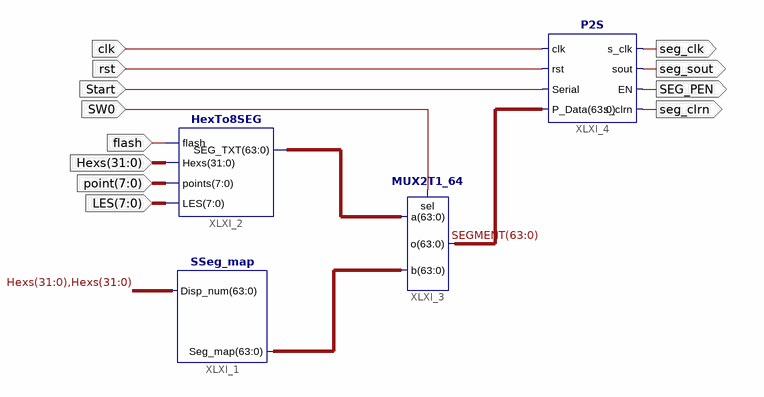
[diagram p0: schematic sheet 1]
// Xilinx ISE schematic SSeg7_Dev.sch (kintex7) as structural Verilog: 4 symbols, 12 ports
module SSeg7_Dev (
  input  flash,
  input  [31:0] Hexs,
  input  [7:0] LES,
  input  [7:0] point,
  input  clk,
  input  rst,
  input  Start,
  input  SW0,
  output seg_clk,
  output seg_sout,
  output SEG_PEN,
  output seg_clrn
);

  wire [63:0] SEGMENT, XLXN_4, XLXN_5;

  SSeg_map XLXI_1 (.Disp_num({Hexs, Hexs}), .Seg_map(XLXN_5));
  HexTo8SEG XLXI_2 (.LES(LES), .points(point), .Hexs(Hexs), .SEG_TXT(XLXN_4), .flash(flash));
  MUX2T1_64 XLXI_3 (.b(XLXN_5), .sel(SW0), .a(XLXN_4), .o(SEGMENT));
  P2S XLXI_4 (
    .s_clrn(seg_clrn), .sout(seg_sout), .rst(rst), .EN(SEG_PEN), .Serial(Start), .clk(clk), .s_clk(seg_clk),
    .P_Data(SEGMENT));
endmodule
